# EAGLE schematic mt10 (EAGLE 8.5.1)
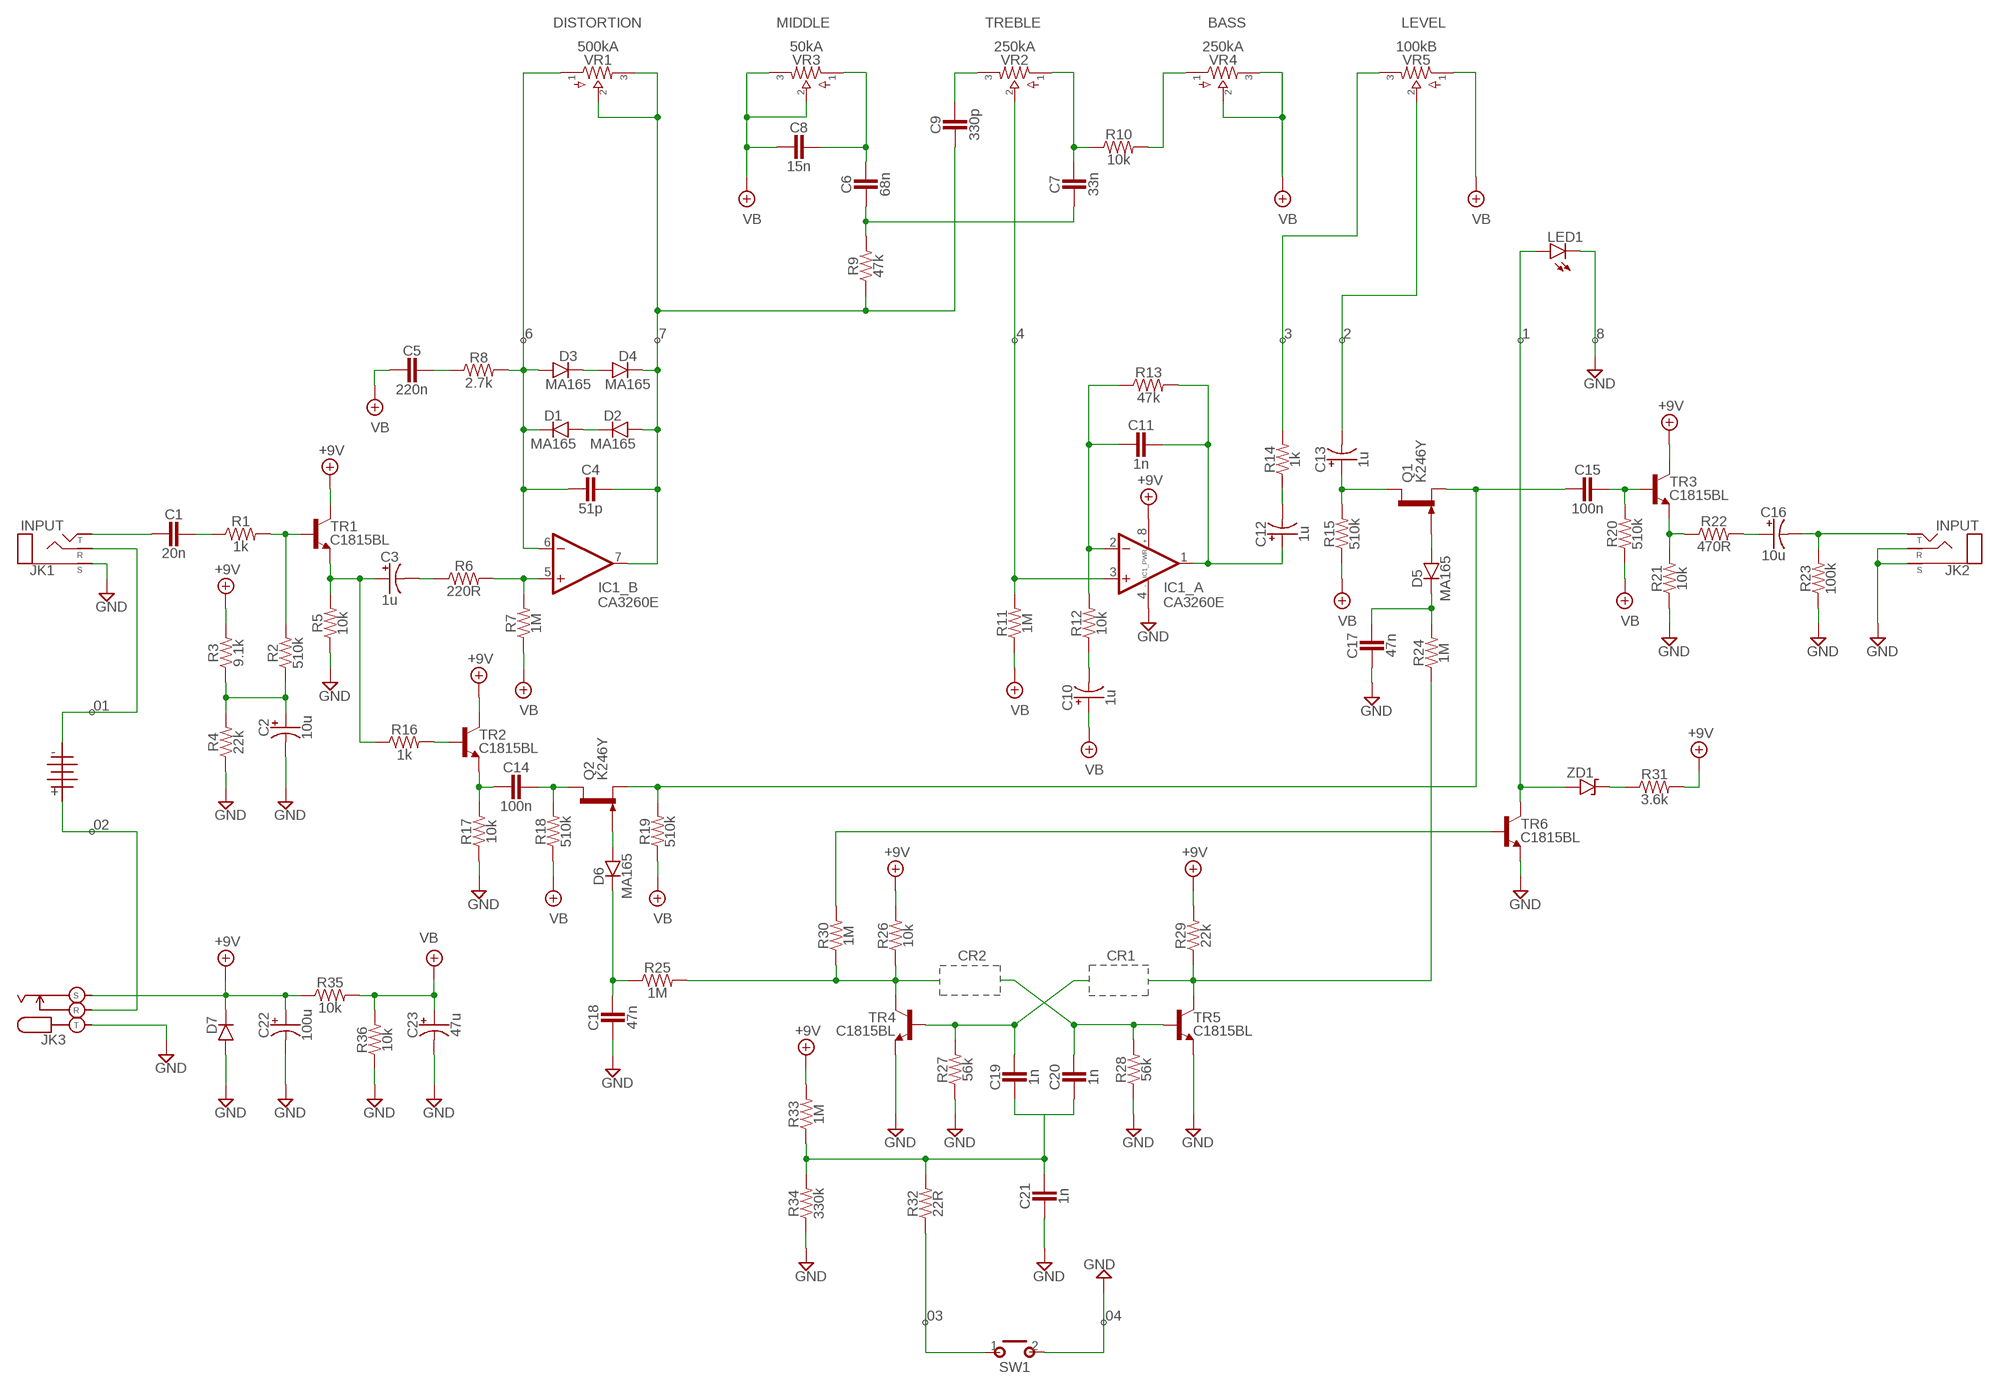
[diagram p0: schematic, sheet 1]

## Parts
1101  BATTERY  [TWO_PADS]
C1  20n  CER/FILMBOX.1  [BOX_SMALL]
C2  10u  0500  [050_020]
C3  1u  0500  [050_020]
C4  51p  CER/FILMBOX.1  [BOX_SMALL]
C5  220n  CER/FILMBOX.1  [BOX_SMALL]
C6  68n  CER/FILMBOX.1  [BOX_SMALL]
C7  33n  CER/FILMBOX.1  [BOX_SMALL]
C8  15n  CER/FILMBOX.1  [BOX_SMALL]
C9  330p  CER/FILMBOX.1  [BOX_SMALL]
C10  1u  0500  [050_020]
C11  1n  CER/FILMBOX.1  [BOX_SMALL]
C12  1u  0500  [050_020]
C13  1u  0500  [050_020]
C14  100n  CER/FILMBOX.1  [BOX_SMALL]
C15  100n  CER/FILMBOX.1  [BOX_SMALL]
C16  10u  0500  [050_020]
C17  47n  CER/FILMBOX.1  [BOX_SMALL]
C18  47n  CER/FILMBOX.1  [BOX_SMALL]
C19  1n  CER/FILMBOX.1  [BOX_SMALL]
C20  1n  CER/FILMBOX.1  [BOX_SMALL]
C21  1n  CER/FILMBOX.1  [BOX_SMALL]
C22  100u  0500  [050_020]
C23  47u  0500  [050_020]
D1  MA165  DO35.2  [DO35-2]
D2  MA165  DO35.2  [DO35-2]
D3  MA165  DO35.2  [DO35-2]
D4  MA165  DO35.2  [DO35-2]
D5  MA165  DO35.2  [DO35-2]
D6  MA165  DO35.2  [DO35-2]
D7  DO35.2  [DO35-2]
IC1  CA3260E  DUALTH  [DIL0]
JK1  INPUT  STEREO3PADS  [THREEPADS]
JK2  INPUT  STEREO3PADS  [THREEPADS]
JK3  DCJACK  DC_KOBICONN  [DC_KOBICONN]
LED1  LED  [3MM_D]
Q1  K246Y  2N5457  [TO92-]
Q2  K246Y  2N5457  [TO92-]
R1  1k  R_.3B  [R0207/3]
R2  510k  R_.3B  [R0207/3]
R3  9.1k  R_.3B  [R0207/3]
R4  22k  R_.3B  [R0207/3]
R5  10k  R_.3B  [R0207/3]
R6  220R  R_.3B  [R0207/3]
R7  1M  R_.3B  [R0207/3]
R8  2.7k  R_.3B  [R0207/3]
R9  47k  R_.3B  [R0207/3]
R10  10k  R_.3B  [R0207/3]
R11  1M  R_.3B  [R0207/3]
R12  10k  R_.3B  [R0207/3]
R13  47k  R_.3B  [R0207/3]
R14  1k  R_.3B  [R0207/3]
R15  510k  R_.3B  [R0207/3]
R16  1k  R_.3B  [R0207/3]
R17  10k  R_.3B  [R0207/3]
R18  510k  R_.3B  [R0207/3]
R19  510k  R_.3B  [R0207/3]
R20  510k  R_.3B  [R0207/3]
R21  10k  R_.3B  [R0207/3]
R22  470R  R_.3B  [R0207/3]
R23  100k  R_.3B  [R0207/3]
R24  1M  R_.3B  [R0207/3]
R25  1M  R_.3B  [R0207/3]
R26  10k  R_.3B  [R0207/3]
R27  56k  R_.3B  [R0207/3]
R28  56k  R_.3B  [R0207/3]
R29  22k  R_.3B  [R0207/3]
R30  1M  R_.3B  [R0207/3]
R31  3.6k  R_.3B  [R0207/3]
R32  22R  R_.3B  [R0207/3]
R33  1M  R_.3B  [R0207/3]
R34  330k  R_.3B  [R0207/3]
R35  10k  R_.3B  [R0207/3]
R36  10k  R_.3B  [R0207/3]
SW1  MOMENTARY  [SPST]
TR1  C1815BL  2SC828A  [TO92-]
TR2  C1815BL  2SC828A  [TO92-]
TR3  C1815BL  2SC828A  [TO92-]
TR4  C1815BL  2SC828A  [TO92-]
TR5  C1815BL  2SC828A  [TO92-]
TR6  C1815BL  2SC828A  [TO92-]
VR1  500kA  POTS16MM  [16MM]
VR2  250kA  POTS16MM  [16MM]
VR3  50kA  POTS16MM  [16MM]
VR4  250kA  POTS16MM  [16MM]
VR5  100kB  POTS16MM  [16MM]
ZD1  ZENER.1  [DO41-1]

## Nets
+9V: C22.+ D7.C IC1.8(_PWR:V+) JK3.S R3.2 R26.2 R29.2 R31.2 R33.2 R35.1 TR1.2(C) TR2.2(C) TR3.2(C)
GND: C2.- C17.2 C18.2 C21.2 C22.- C23.- D7.A IC1.4(_PWR:V-) JK1.SLEEVE(S) JK2.RING(R) JK2.SLEEVE(S) JK3.T LED1.P$1(C) R4.1 R5.1 R17.1 R21.1 R23.1 R27.1 R28.1 R34.1 R36.1 SW1.2(S) TR4.3(E) TR5.3(E) TR6.3(E)
N$1: C1.2 JK1.TIP(T)
N$2: 1101.S JK1.RING(R)
N$3: C1.1 R1.1
N$4: R1.2 R2.2 TR1.1(B)
N$5: C2.+ R2.1 R3.1 R4.2
N$6: C3.+ R5.2 R16.1 TR1.3(E)
N$7: C4.2 D1.C D3.A IC1.6(_B:-IN) R8.2 VR1.1
N$8: C4.1 C9.2 D2.A D4.C IC1.7(_B:OUT) R9.1 VR1.2 VR1.3
N$9: C3.- R6.1
N$10: IC1.5(_B:+IN) R6.2 R7.2
N$11: D1.A D2.C
N$12: C5.1 R8.1
N$13: D3.C D4.A
N$14: C7.1 R10.1 VR2.1
N$15: R16.2 TR2.1(B)
N$16: R10.2 VR4.1
N$17: R14.2 VR5.3
N$18: C6.2 C7.2 R9.2
N$19: IC1.3(_A:+IN) R11.2 VR2.2
N$20: C10.- R12.1
N$21: C11.2 IC1.2(_A:-IN) R12.2 R13.1
N$22: C11.1 C12.+ IC1.1(_A:OUT) R13.2
N$23: C12.- R14.1
N$24: C13.- VR5.2
N$25: C13.+ Q1.3(D) R15.2
N$26: C18.1 D6.C R25.1
N$27: C15.2 Q1.2(S) Q2.2(S) R19.2
N$28: C14.2 R17.2 TR2.3(E)
N$29: C19.2 C20.2 C21.1 R32.2 R33.1 R34.2
N$30: C14.1 Q2.3(D) R18.2
N$31: R24.1 R29.1 TR5.2(C)
N$32: C19.1 R27.2 TR4.1(B)
N$33: D6.A Q2.1(G)
N$34: C20.1 R28.2 TR5.1(B)
N$36: 1101.T JK3.R
N$37: R30.2 TR6.1(B)
N$38: LED1.ANODE(A) TR6.2(C) ZD1.A
N$39: R25.2 R26.1 R30.1 TR4.2(C)
N$40: R31.1 ZD1.C
N$41: D5.A Q1.1(G)
N$42: C17.1 D5.C R24.2
N$43: R32.1 SW1.1(P)
N$44: C16.- JK2.TIP(T) R23.2
N$45: C16.+ R22.2
N$46: R21.2 R22.1 TR3.3(E)
N$47: C15.1 R20.2 TR3.1(B)
N$54: C6.1 C8.1 VR3.1
VB: C5.2 C8.2 C10.+ C23.+ R7.1 R11.1 R15.1 R18.1 R19.1 R20.1 R35.2 R36.2 VR3.2 VR3.3 VR4.2 VR4.3 VR5.1
VB1: C9.1 VR2.3

## Notes on the sheet
- DISTORTION | MIDDLE | TREBLE | BASS | LEVEL
- 6 | 7 | 4 | 3 | 2 | 1 | 8
- 01
- 02
- CR2 | CR1
- 03 | 04

## Library data of the parts
1101 = pedals-jacks:BATTERY
C1 C4-C9 C11 C14 C15 C17-C21 = pedals-capacitors-film:CER/FILM: 47 - 120pF Xicon Ceramic Disc 2.5mm lead spacing
C2 C3 C10 C12 C13 C16 C22 C23 = pedals-capacitors-elec:050
D1-D7 = pedals-diodes:DO35: DO-35 Package Diodes: 1N914
IC1 = pedals-integrated circuits:DUAL: OP AMP
JK1 JK2 = pedals-jacks:STEREO
JK3 = pedals-jacks:DC_KOBICONN
LED1 = pedals-diodes:LED
Q1 Q2 = pedals-transistors:2N5457: N-CHANNEL JFET
R1-R36 = pedals-resistors:R_
SW1 = pedals-switches:MOMENTARY
TR1-TR6 = pedals-transistors:2SC828A
VR1-VR5 = pedals-potentiometers:POTS
ZD1 = pedals-diodes:ZENER